# Altium schematic sheet monitoring_ADC.SchDoc
size A; SheetNumber: 9; SheetTotal: 9
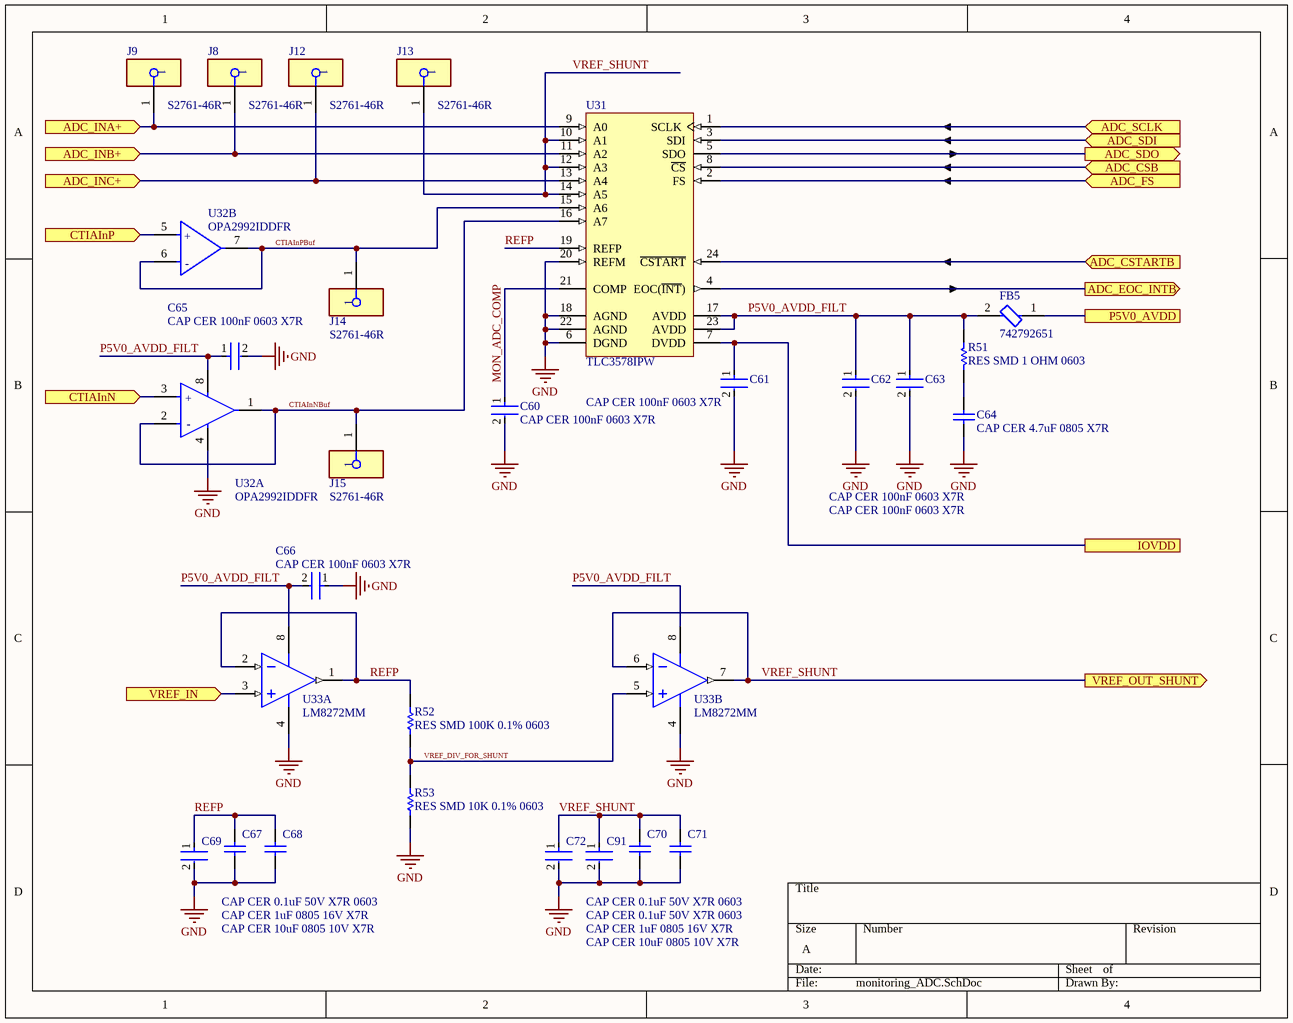
[diagram p0: monitoring_ADC.SchDoc]

## Parts
C60  CAP CER 100nF 0603 X7R  [FP-CC0603-DA-MFG]
C61  CAP CER 100nF 0603 X7R  [FP-CC0603-DA-MFG]
C62  CAP CER 100nF 0603 X7R  [FP-CC0603-DA-MFG]
C63  CAP CER 100nF 0603 X7R  [FP-CC0603-DA-MFG]
C64  CAP CER 4.7uF 0805 X7R  [CAPC2013X140X50NL20T25]
C65  CAP CER 100nF 0603 X7R  [FP-CC0603-DA-MFG]
C66  CAP CER 100nF 0603 X7R  [FP-CC0603-DA-MFG]
C67  CAP CER 1uF 0805 16V X7R  [CAPC2013X140X50NL20T25]
C68  CAP CER 10uF 0805 10V X7R  [CAPC2013X140X50NL20T25]
C69  CAP CER 0.1uF 50V X7R 0603  [FP-CC0603-DA-MFG]
C70  CAP CER 1uF 0805 16V X7R  [CAPC2013X140X50NL20T25]
C71  CAP CER 10uF 0805 10V X7R  [CAPC2013X140X50NL20T25]
C72  CAP CER 0.1uF 50V X7R 0603  [FP-CC0603-DA-MFG]
C91  CAP CER 0.1uF 50V X7R 0603  [FP-CC0603-DA-MFG]
FB5  742792651  [FP-742792651-MFG]
J8  S2761-46R  [FP-S2761-46R-MFG]
J9  S2761-46R  [FP-S2761-46R-MFG]
J12  S2761-46R  [FP-S2761-46R-MFG]
J13  S2761-46R  [FP-S2761-46R-MFG]
J14  S2761-46R  [FP-S2761-46R-MFG]
J15  S2761-46R  [FP-S2761-46R-MFG]
R51  RES SMD 1 OHM 0603  [RESC1609X50X30LL10T20]
R52  RES SMD 100K 0.1% 0603  [RESC1609X50X30LL10T20]
R53  RES SMD 10K 0.1% 0603  [RESC1609X50X30LL10T20]
U31  TLC3578IPW  [TI-PW24_N]
U32  OPA2992IDDFR  [FP-DDF0008A-MFG]  (parts A,B of 2)
U33  LM8272MM  [DGK0008A_L]  (parts A,B of 2)

## Ports
ADC_CSB (in), ADC_CSTARTB (in), ADC_EOC_INTB (out), ADC_FS (in), ADC_INA+ (in), ADC_INB+ (in), ADC_INC+ (in), ADC_SCLK (in), ADC_SDI (in), ADC_SDO (out), CTIAInN (in), CTIAInP (in), IOVDD, P5V0_AVDD, VREF_IN (in), VREF_OUT_SHUNT (out)

## Nets
GND: C60.2 C61.2 C62.2 C63.2 C64.2 C65.2 C66.1 C67.2 C68.2 C69.2 C70.2 C71.2 C72.2 C91.2 R53.1 U31.6(DGND) U31.18(AGND) U31.20(REFM) U31.22(AGND) U32.4(V-) U33.4(V-)
ADC_CSB: U31.8(~{CS}) ; port ADC_CSB
ADC_CSTARTB: U31.24(~{CSTART}) ; port ADC_CSTARTB
ADC_EOC_INTB: U31.4(EOC(~{INT})) ; port ADC_EOC_INTB
ADC_FS: U31.2(FS) ; port ADC_FS
ADC_INA+: J9.1 U31.9(A0) ; port ADC_INA+
ADC_INB+: J8.1 U31.11(A2) ; port ADC_INB+
ADC_INC+: J12.1 U31.13(A4) ; port ADC_INC+
ADC_SCLK: U31.1(SCLK) ; port ADC_SCLK
ADC_SDI: U31.3(SDI) ; port ADC_SDI
ADC_SDO: U31.5(SDO) ; port ADC_SDO
CTIAInN: U32.3(IN1+) ; port CTIAInN
CTIAInNBuf: J15.1 U31.16(A7) U32.1(OUT1) U32.2(IN1-)
CTIAInP: U32.5(IN2+) ; port CTIAInP
CTIAInPBuf: J14.1 U31.15(A6) U32.6(IN2-) U32.7(OUT2)
IOVDD: C61.1 U31.7(DVDD) ; port IOVDD
MON_ADC_COMP: C60.1 U31.21(COMP)
P5V0_AVDD: FB5.1 ; port P5V0_AVDD
P5V0_AVDD_FILT: C62.1 C63.1 C65.1 C66.2 FB5.2 R51.2 U31.17(AVDD) U31.23(AVDD) U32.8(V+) U33.8(V+)
REFP: C67.1 C68.1 C69.1 R52.2 U31.19(REFP) U33.1(OUTA) U33.2(INA-)
VREF_DIV_FOR_SHUNT: R52.1 R53.2 U33.5(INB+)
VREF_IN: U33.3(INA+) ; port VREF_IN
VREF_SHUNT: C70.1 C71.1 C72.1 C91.1 J13.1 U31.10(A1) U31.12(A3) U31.14(A5) U33.6(INB-) U33.7(OUTB) ; port VREF_OUT_SHUNT
NetC64_1: C64.1 R51.1

## Notes on the sheet
- (in symbol CMP-04895-000462-1, part A) +; -
- (in symbol CMP-04895-000462-1, part B) +; -

## Library data of the parts
C60-C63 C65 C66 = CMP-03422-000030-1: CAP CER 0.1UF 16V X7R 0603; Manufacturer Part Number: CC0603KRX7R7BB104; Manufacturer: YAGEO; Tolerance: 0.1; Temperature Coefficient: 15%; Material: Ceramic; Voltage Rating: 16 V; Package: CC0603-DA; ComponentLink2Description: Datasheet; Octopart: https://octopart.com/cc0603krx7r7bb104-yageo-192941; Temperature Range High: +125°C; Digikey Description: CAP CER 0.1UF 16V X7R 0603; Value: 100 nF; Voltage: 16 V; Device Class L2: Capacitors; Height: 0.9mm; Temperature: -55°C to +125°C; Device Class L1: Passive Components; Device Class L3: Ceramic Capacitors; ComponentLink2URL: http://www.yageo.com/documents/recent/UPY-GPHC_X7R_6.3V-to-50V_18.pdf; Footprint Url: http://www.yageo.com/exep/pages/download/literatures/UPY-C_GEN_24.pdf; RoHS: TRUE; Temperature Range Low: -55°C; Temperature Characteristic: X7R; Lead Free: Yes; Capacitance: 100 nF; Category: Cap; Mouser Description: Multilayer Ceramic Capacitor, CC Series, 0.1 - F, - 10%, X7R, 16 V, 0603 [1608 Metric]; Automotive: No
C64 C67 C68 C70 C71 = CMP-2007-04677-1: Part Number: 0805ZC475KAT2A; Manufacturer: AVX Interconnect / Elco
C69 C72 C91 = CMP-03422-000030-1: Manufacturer Part Number: CC0603KRX7R7BB104; Manufacturer: YAGEO; Voltage Rating: 16 V; Tolerance: 0.1; Value: 100 nF; Temperature Coefficient: 15%; Material: Ceramic; Package: CC0603-DA; ComponentLink2Description: Datasheet; Octopart: https://octopart.com/cc0603krx7r7bb104-yageo-192941; Temperature Range High: +125°C; Digikey Description: CAP CER 0.1UF 16V X7R 0603; Voltage: 16 V; Device Class L2: Capacitors; Height: 0.9mm; Temperature: -55°C to +125°C; Device Class L1: Passive Components; Device Class L3: Ceramic Capacitors; ComponentLink2URL: http://www.yageo.com/documents/recent/UPY-GPHC_X7R_6.3V-to-50V_18.pdf; Footprint Url: http://www.yageo.com/exep/pages/download/literatures/UPY-C_GEN_24.pdf; RoHS: TRUE; Temperature Range Low: -55°C; Temperature Characteristic: X7R; Lead Free: Yes; Capacitance: 100 nF; Category: Cap; Mouser Description: Multilayer Ceramic Capacitor, CC Series, 0.1 - F, - 10%, X7R, 16 V, 0603 [1608 Metric]; Automotive: No
FB5 = CMP-0220-00181-2: FERRITE BEAD 600 OHM 0603 1LN; Tolerance: 25%; DC Resistance (DCR): 200mR; Inductance: 0.36H; Current Rating: 1A; Test Frequency: 100MHz; Impedance: 600R; Number of Lines: 1; Length: 1.6mm; Termination: SMD/SMT; Case Code (Metric): 1608; Case/Package: SMD/SMT; Min Operating Temperature: -55°C; Resistance: 200mR; Height: 0.8mm; Width: 0.8mm; Max Operating Temperature: 125°C; Package Quantity: 1; Mount: Surface Mount; Max DC Current: 1A; Max Current Rating: 1A; Weight: 0.000141oz; Packaging: Tape and Reel; Lead Free: Lead Free; Case Code (Imperial): 0603; Series: WE-CBF; Core Material: Ferrite; Material: Ferrite; RoHS Compliant: Yes; Depth: 0.8mm
J8 J9 J12-J15 = CMP-15817-000011-1: PC TEST POINT NATURAL; Body Material: Brass; Plating: Tin; Material: Copper Alloy; Mount: Surface Mount; Color: Natural; Packaging: Tape and Reel; RoHS Compliant: Yes
R51 = CMP-2000-03820-1: Part Number: CRCW0603100KFKEA; Manufacturer: Vishay Dale
R52 R53 = CMP-2000-03820-1: DNP; Part Number: CRCW0603100KFKEA; Manufacturer: Vishay Dale
U31 = CMP-0003-02027-1: Serial Out, Low Power with Built-In Conversion Clock and 8 x FIFO, 8 Channel, -40 to 85 degC, 24-pin SOP (PW24), Green (RoHS & no Sb/Br); Manufacturer: Texas Instruments; Interface: Serial SPI; SubFamily: Precision ADC (<=10MSPS); SNR(dB): 80; INL(Max)(+/-LSB): 1.5; Analog Voltage AV/DD(Min)(V): 4.75; Digital Supply(Max)(V): 5.5; SFDR(dB): 84; # Input Channels: 8; Resolution(Bits): 14; SINAD(dB): 79; Sample Rate (max)(SPS): 200k; ENOB(Bits): 12.8; Architecture: SAR; Digital Supply(Min)(V): 2.7; ComponentLink2Description: Datasheet; ComponentLink2URL: http://www.ti.com/general/docs/lit/getliterature.tsp?genericPartNumber=TLC3578&fileType=pdf; ComponentLink1URL: http://www.ti.com/; Code_JEDEC: MO-153; PackageDescription: 24-Pin Plastic Small Outline, Body 7.8 x 4.4 mm, Pitch 0.65 mm; PartNumber: TLC3578IPW; PackageVersion: 4040064-6/G, 02/2011; PackageReference: PW24; DatasheetVersion: SLAS262C; Eco-Plan: Green (RoHS & no Sb/Br); Analog Voltage AV/DD(Max)(V): 5.5; ComponentLink3URL: http://www.ti.com/litv/pdf/mpds363; Mounting Technology: Surface Mount; ComponentLink1Description: Manufacturer URL; ComponentLink3Description: Package Specification
U32 = CMP-04895-000462-1: IC OPAMP GP 2 CIRCUIT TSOT23-8
U33 = CMP-0055-01394-3: RRIO, High Output Current & Unlimited Cap Load Op Amp, 8-pin Mini SOIC; Manufacturer: Texas Instruments; CompType: Amplifiers; PowerWise: N; PackageTopMarking: ZXTT*A60; RoHS: N; ComponentLink1Description: Datasheet URL; PinCount: 8; Code_JEDEC: MO-187-AA; Package Reference: DGK0008A; ComponentLink1URL: http://www.ti.com/general/docs/lit/getliterature.tsp?genericPartNumber=LM8272&fileType=pdf; PackageDescription: MINI SOIC, .118 x .118 x .034in, 8 Lead, .0256in Pitch